# Altium schematic sheet 04_Mechanical.SchDoc: Mechanicals
size A; Revision: A; SheetNumber: 4; SheetTotal: 4; ECE315_Project_Name: ECE453 Base Project
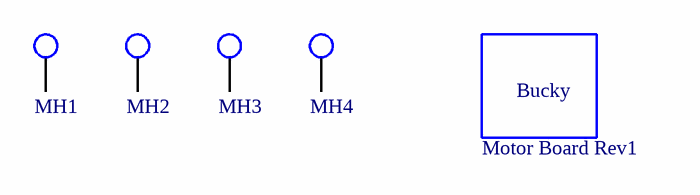
[diagram p0: 04_Mechanical.SchDoc]

## Parts
MH1  MHOLE_2_55MM  [MHOLE_2_55MM]  (value not drawn)  (no BOM)
MH2  MHOLE_2_55MM  [MHOLE_2_55MM]  (value not drawn)  (no BOM)
MH3  MHOLE_2_55MM  [MHOLE_2_55MM]  (value not drawn)  (no BOM)
MH4  MHOLE_2_55MM  [MHOLE_2_55MM]  (value not drawn)  (no BOM)
Motor_Board_Rev1  Bucky  [WalkingBucky]  (value not drawn)  (no BOM)

## Nets

Not connected (* = marked no-connect by the designer): MH1 1; MH2 1; MH3 1; MH4 1

## Notes on the sheet
- Title:
- Size:
- A
- Project
- Rev:
- Sheet:
- of
- College of Engineering
- 1415 Engineering Drive
- Madison, WI 53706

## Library data of the parts
MH1-MH4 = MHOLE_2_55MM: Mounting Holde; Manufacturer Part Number: UW MTHOLE
Motor_Board_Rev1 = Bucky: Bucky Badger Image; Manufacturer Part Number: UW Bucky